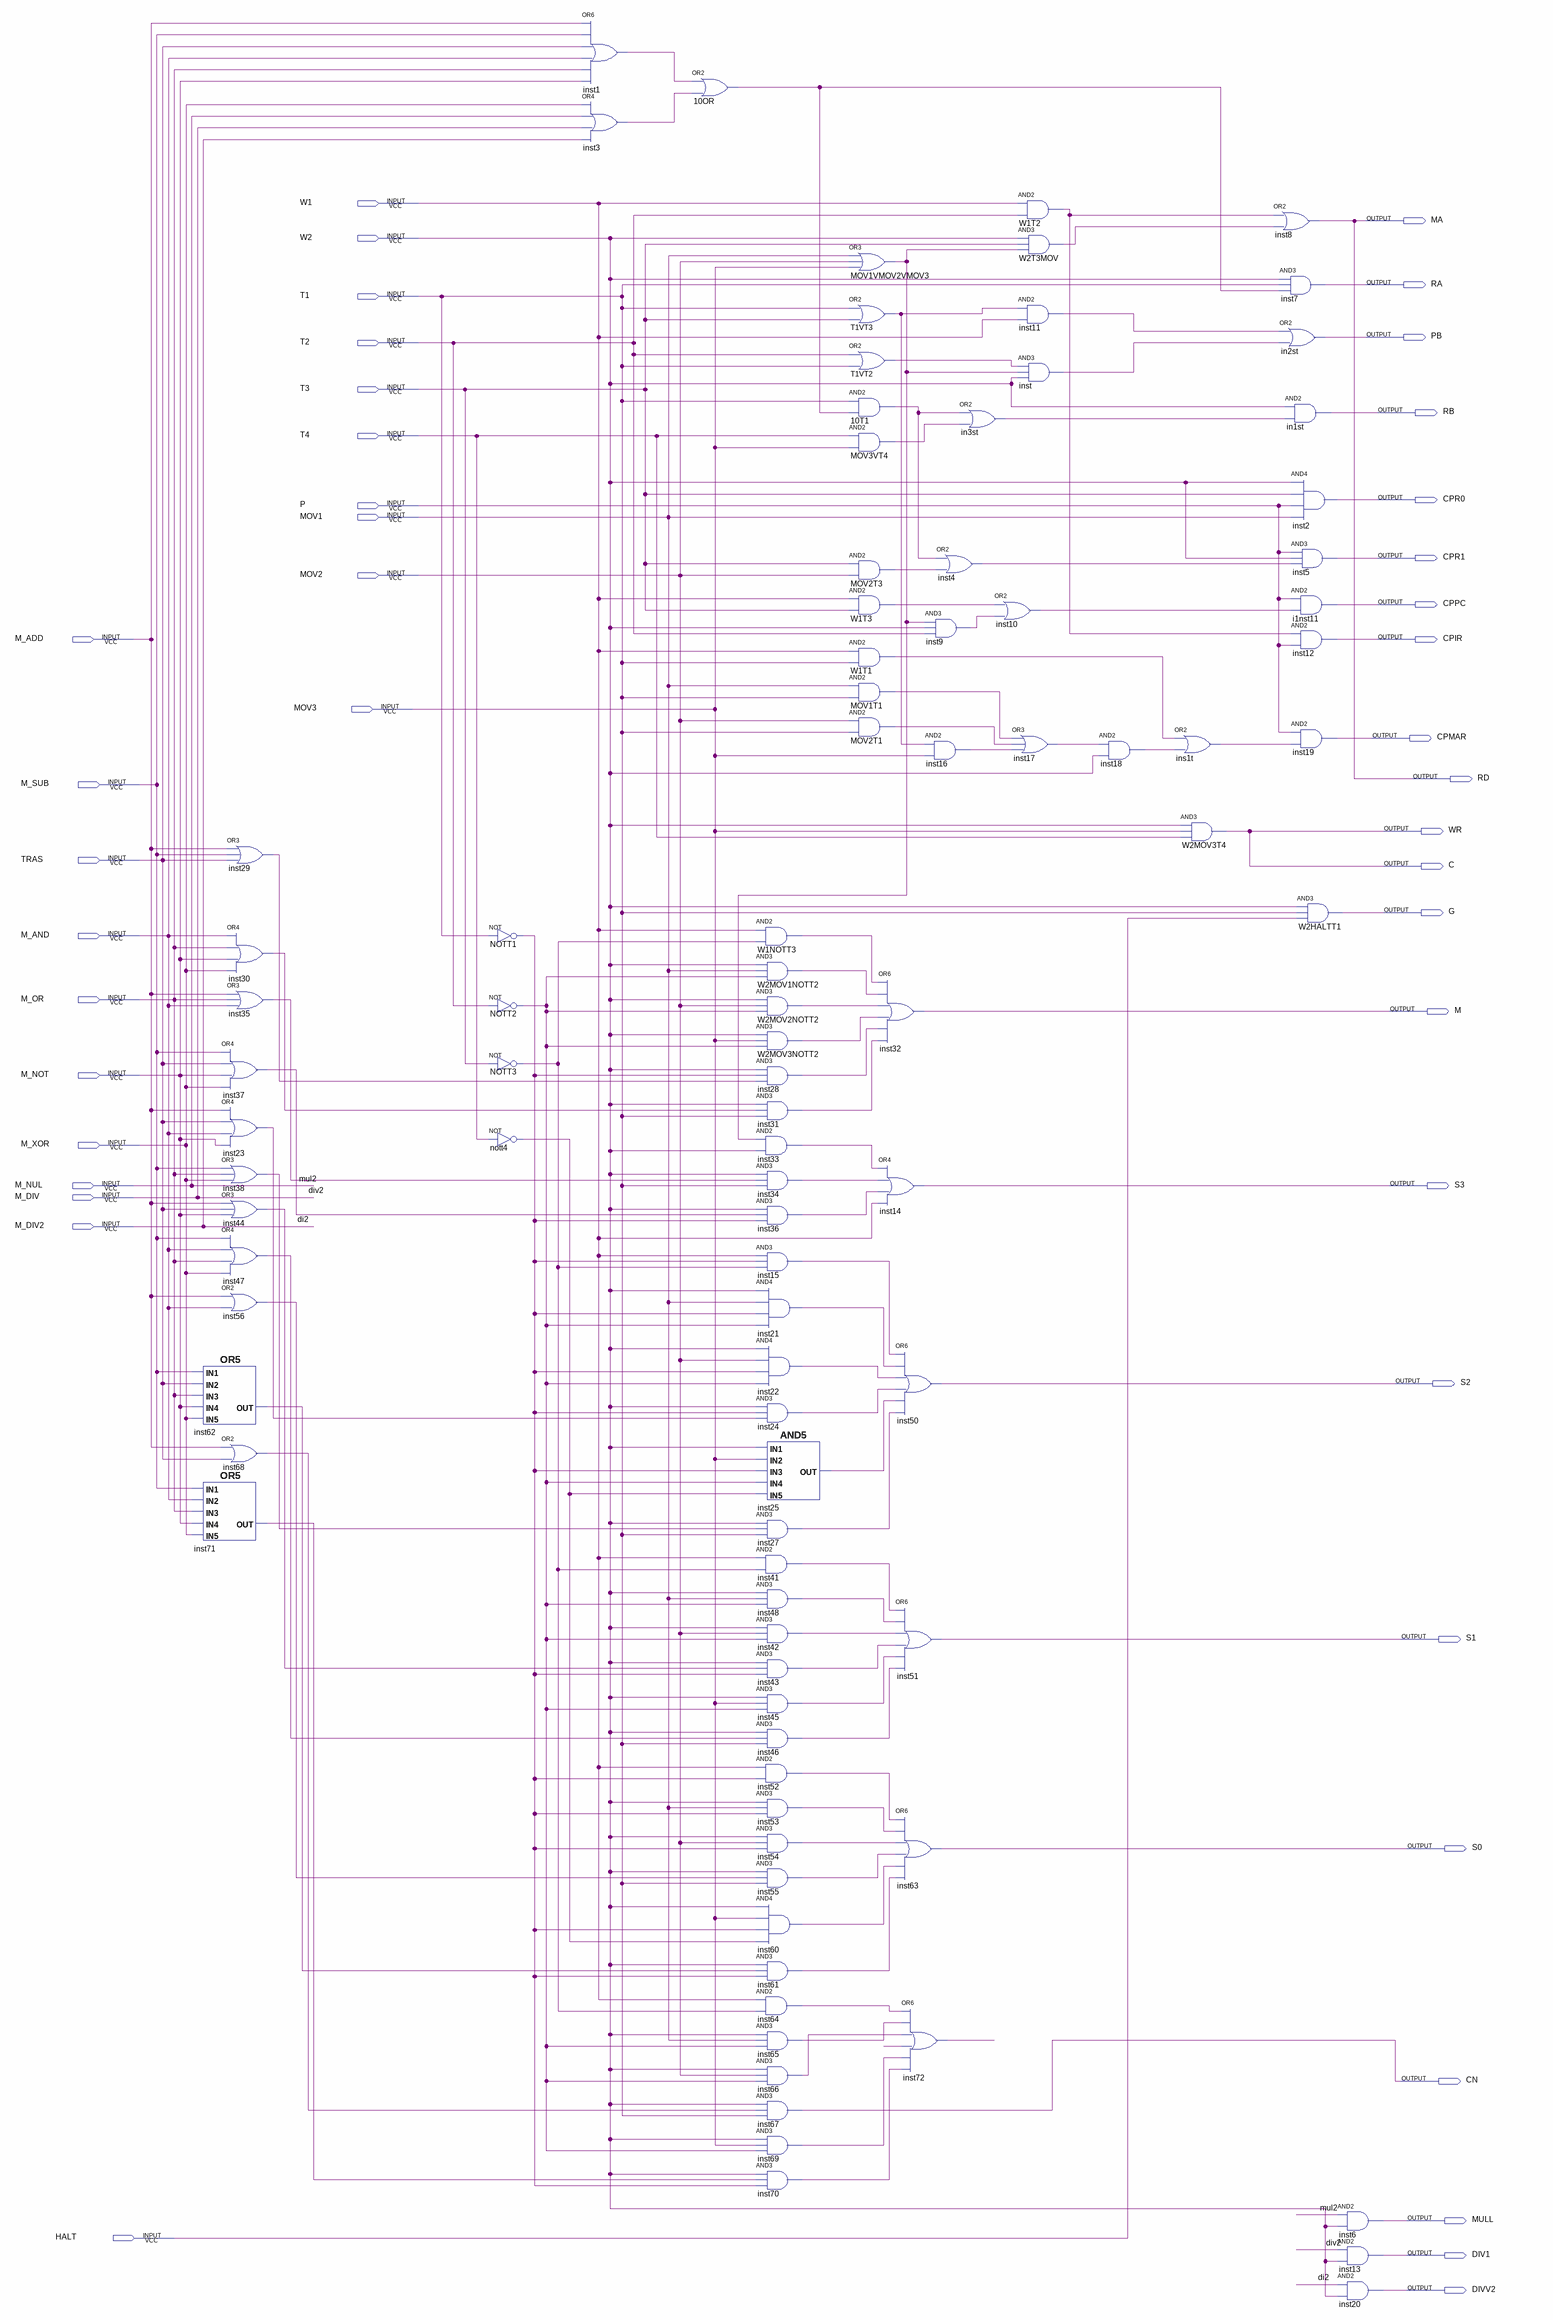
[diagram p0: schematic sheet]
// Quartus schematic control.bdf as structural Verilog: 94 symbols, 43 pins
module control (
  input  W1,
  input  W2,
  input  T1,
  input  T2,
  input  T3,
  input  T4,
  input  P,
  input  MOV1,
  input  MOV2,
  input  M_ADD,
  input  MOV3,
  input  M_SUB,
  input  TRAS,
  input  M_AND,
  input  M_OR,
  input  M_NOT,
  input  M_XOR,
  input  M_NUL,
  input  M_DIV,
  input  M_DIV2,
  input  HALT,
  output MA,
  output RA,
  output PB,
  output RB,
  output CPR0,
  output CPR1,
  output CPPC,
  output CPIR,
  output CPMAR,
  output RD,
  output WR,
  output C,
  output G,
  output M,
  output S3,
  output S2,
  output S1,
  output S0,
  output CN,
  output MULL,
  output DIV1,
  output DIVV2
);

  wire in3st_out, ins1t_out, inst1_out, inst3_out, inst4_out, inst9_out, inst10_out, inst11_out, inst15_out,
       inst16_out, inst17_out, inst18_out, inst21_out, inst22_out, inst23_out, inst24_out, inst25_out,
       inst27_out, inst28_out, inst29_out, inst30_out, inst31_out, inst33_out, inst34_out, inst35_out,
       inst36_out, inst37_out, inst38_out, inst41_out, inst42_out, inst43_out, inst44_out, inst45_out,
       inst46_out, inst47_out, inst48_out, inst52_out, inst53_out, inst54_out, inst55_out, inst56_out,
       inst60_out, inst61_out, inst62_out, inst64_out, inst65_out, inst66_out, inst68_out, inst69_out,
       inst70_out, inst71_out, inst72_out, inst_out, MOV1T1_out, MOV1VMOV2VMOV3_out, MOV2T1_out, MOV2T3_out,
       MOV3VT4_out, n10OR_out, n10T1_out, NOTT1_out, NOTT2_out, NOTT3_out, nott4_out, T1VT2_out, T1VT3_out,
       undriven, W1NOTT3_out, W1T1_out, W1T2_out, W1T3_out, W2MOV1NOTT2_out, W2MOV2NOTT2_out,
       W2MOV3NOTT2_out, W2T3MOV_out;

  or inst29 (inst29_out, M_ADD, M_SUB, TRAS);
  or inst30 (inst30_out, M_AND, M_OR, M_NOT, M_XOR);
  or inst35 (inst35_out, M_ADD, M_OR, M_AND);
  or inst37 (inst37_out, M_SUB, TRAS, M_NOT, M_XOR);
  or inst23 (inst23_out, M_ADD, TRAS, M_AND, M_NOT);
  or inst38 (inst38_out, M_SUB, M_OR, M_XOR);
  or inst44 (inst44_out, M_ADD, TRAS, M_NOT);
  or inst47 (inst47_out, M_SUB, M_AND, M_OR, M_XOR);
  or inst56 (inst56_out, M_ADD, M_AND);
  or inst62 (inst62_out, M_SUB, TRAS, M_OR, M_NOT, M_XOR);
  or inst68 (inst68_out, M_ADD, TRAS);
  or inst71 (inst71_out, M_SUB, M_AND, M_OR, M_NOT, M_XOR);
  not NOTT1 (NOTT1_out, T1);
  not NOTT2 (NOTT2_out, T2);
  not NOTT3 (NOTT3_out, T3);
  not nott4 (nott4_out, T4);
  or inst1 (inst1_out, M_ADD, M_SUB, TRAS, M_AND, M_OR, M_NOT);
  or inst3 (inst3_out, M_XOR, M_NUL, M_DIV, M_DIV2);
  or u_10OR (n10OR_out, inst1_out, inst3_out);
  and W1NOTT3 (W1NOTT3_out, W1, NOTT3_out);
  and W2MOV1NOTT2 (W2MOV1NOTT2_out, W2, MOV1, NOTT2_out);
  and W2MOV2NOTT2 (W2MOV2NOTT2_out, W2, MOV2, NOTT2_out);
  and W2MOV3NOTT2 (W2MOV3NOTT2_out, W2, MOV3, NOTT2_out);
  and inst28 (inst28_out, W2, NOTT1_out, inst29_out);
  and inst31 (inst31_out, W2, inst30_out, T1);
  and inst33 (inst33_out, MOV1VMOV2VMOV3_out, W2);
  and inst34 (inst34_out, W2, inst35_out, T1);
  and inst36 (inst36_out, W2, inst37_out, NOTT1_out);
  and inst15 (inst15_out, W1, NOTT1_out, NOTT3_out);
  and inst21 (inst21_out, W2, MOV1, NOTT1_out, NOTT2_out);
  and inst22 (inst22_out, W2, MOV2, NOTT1_out, NOTT2_out);
  and inst24 (inst24_out, W2, NOTT1_out, inst23_out);
  and inst25 (inst25_out, W2, MOV3, NOTT1_out, NOTT2_out, nott4_out);
  and inst27 (inst27_out, W2, inst38_out, T1);
  and inst41 (inst41_out, W1, NOTT3_out);
  and inst48 (inst48_out, W2, MOV1, NOTT2_out);
  and inst42 (inst42_out, W2, MOV2, NOTT2_out);
  and inst43 (inst43_out, W2, inst44_out, NOTT1_out);
  and inst45 (inst45_out, W2, MOV3, NOTT2_out);
  and inst46 (inst46_out, W2, inst47_out, T1);
  and inst52 (inst52_out, W1, NOTT1_out);
  and inst53 (inst53_out, W2, MOV1, NOTT1_out);
  and inst54 (inst54_out, W2, MOV2, NOTT1_out);
  and inst55 (inst55_out, W2, inst56_out, T1);
  and inst60 (inst60_out, W2, MOV3, NOTT1_out, nott4_out);
  and inst61 (inst61_out, W2, inst62_out, NOTT1_out);
  and inst64 (inst64_out, W1, NOTT3_out);
  and inst65 (inst65_out, W2, MOV1, NOTT2_out);
  and inst66 (inst66_out, W2, MOV2, NOTT2_out);
  and inst67 (CN, W2, inst68_out, T1);
  and inst69 (inst69_out, W2, MOV3, NOTT2_out);
  and inst70 (inst70_out, W2, inst71_out, NOTT1_out);
  or MOV1VMOV2VMOV3 (MOV1VMOV2VMOV3_out, MOV1, MOV2, MOV3);
  or T1VT3 (T1VT3_out, T1, T3);
  or T1VT2 (T1VT2_out, T2, T1);
  and u_10T1 (n10T1_out, T1, n10OR_out);
  and MOV3VT4 (MOV3VT4_out, T4, MOV3);
  and MOV2T3 (MOV2T3_out, T3, MOV2);
  and W1T3 (W1T3_out, W1, T3);
  and W1T1 (W1T1_out, W1, T1);
  and MOV1T1 (MOV1T1_out, MOV1, T1);
  and MOV2T1 (MOV2T1_out, MOV2, T1);
  or inst32 (M, W1NOTT3_out, W2MOV1NOTT2_out, W2MOV2NOTT2_out, W2MOV3NOTT2_out, inst28_out, inst31_out);
  or inst14 (S3, inst33_out, inst34_out, inst36_out, W1);
  and inst9 (inst9_out, MOV1VMOV2VMOV3_out, W2, T2);
  and inst16 (inst16_out, T1VT3_out, MOV3);
  or inst50 (S2, inst15_out, inst21_out, inst22_out, inst24_out, inst25_out, inst27_out);
  or inst51 (S1, inst41_out, inst48_out, inst42_out, inst43_out, inst45_out, inst46_out);
  or inst63 (S0, inst52_out, inst53_out, inst54_out, inst55_out, inst60_out, inst61_out);
  or inst72 (inst72_out, inst64_out, inst65_out, inst66_out, undriven, inst69_out, inst70_out);
  or in3st (in3st_out, n10T1_out, MOV3VT4_out);
  or inst4 (inst4_out, n10T1_out, MOV2T3_out);
  and W1T2 (W1T2_out, W1, T2);
  and W2T3MOV (W2T3MOV_out, W2, T3, MOV1VMOV2VMOV3_out);
  and inst11 (inst11_out, T1VT3_out, W1);
  and inst (inst_out, T1VT2_out, MOV1VMOV2VMOV3_out, W2);
  or inst10 (inst10_out, W1T3_out, inst9_out);
  or inst17 (inst17_out, MOV1T1_out, MOV2T1_out, inst16_out);
  and inst18 (inst18_out, inst17_out, W2);
  or ins1t (ins1t_out, W1T1_out, inst18_out);
  and W2MOV3T4 (C, W2, MOV3, T4);
  or inst8 (MA, W1T2_out, W2T3MOV_out);
  and inst7 (RA, W2, T1, n10OR_out);
  or in2st (PB, inst11_out, inst_out);
  and in1st (RB, W2, in3st_out);
  and inst2 (CPR0, W2, T3, P, MOV1);
  and inst5 (CPR1, P, W2, inst4_out);
  and i1nst11 (CPPC, P, inst10_out);
  and inst12 (CPIR, W1T2_out, P);
  and inst19 (CPMAR, P, ins1t_out);
  and W2HALTT1 (G, W2, T1, HALT);
  and inst6 (MULL, M_NUL, W2);
  and inst13 (DIV1, M_DIV, W2);
  and inst20 (DIVV2, M_DIV2, W2);

  assign RD = MA;
  assign WR = C;

  // Other names for the same wires on the sheet: div2 = M_DIV; di2 = M_DIV2; mul2 = M_NUL
endmodule
